# Altium project POWER-BOARD.PrjPcb
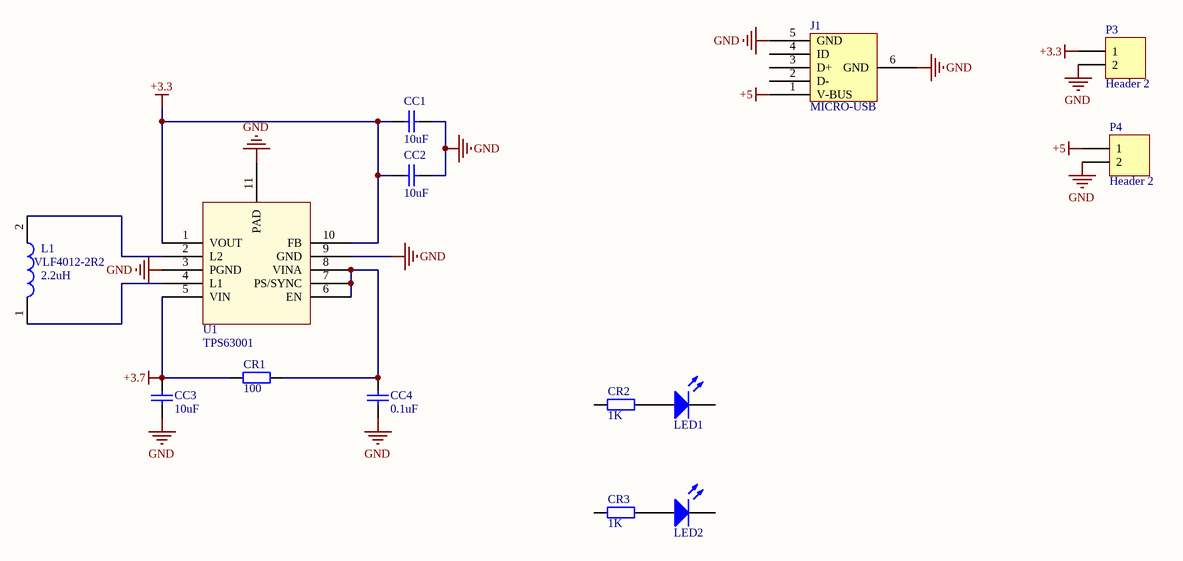
[diagram p0: POWER-BOARD.SchDoc]
1 sheet, 14 parts. Net scope: global (net labels, ports and power ports of the same name join across sheets).
Board file: POWER-BOARD.PcbDoc

## Sheet POWER-BOARD.SchDoc
size A4

### Parts
CC1  value 10uF  [CC1608-0603]  (hidden comment: Cap Chip 0603)
CC2  value 10uF  [CC1608-0603]  (hidden comment: Cap Chip 0603)
CC3  value 10uF  [CC1608-0603]  (hidden comment: Cap Chip 0603)
CC4  value 0.1uF  [CC1005-0402]  (hidden comment: Cap Chip 0402)
CR1  value 100  [CR1005-0402]  (hidden comment: Resistor Chip 0402)
CR2  value 1K  [CR1005-0402]  (hidden comment: Resistor Chip 0402)
CR3  value 1K  [CR1005-0402]  (hidden comment: Resistor Chip 0402)
J1  MICRO-USB  [MICRO-USB]
L1  VLF4012-2R2  L: 2.2uH  [VLF4012-2R2-INDUCTOR]
LED1  LED Chip  [CLED1005-0402]  (value not drawn)
LED2  LED Chip  [CLED1005-0402]  (value not drawn)
P3  Header 2  [HDR1X2]
P4  Header 2  [HDR1X2]
U1  TPS63001  [TPS63001]

### Nets
+3.3: CC1.1 CC2.1 P3.1 U1.1(VOUT) U1.10(FB)
+3.7: CC3.2 CR1.1 U1.5(VIN)
+5: J1.1(V-BUS) P4.1
GND: CC1.2 CC2.2 CC3.1 CC4.1 J1.5(GND) J1.6(GND) P3.2 P4.2 U1.3(PGND) U1.9(GND) U1.11(PAD)
NetCC4_2: CC4.2 CR1.2 U1.6(EN) U1.7(PS/SYNC) U1.8(VINA)
NetCR2_2: CR2.2 LED1.1(A)
NetCR3_2: CR3.2 LED2.1(A)
NetL1_1: L1.1 U1.4(L1)
NetL1_2: L1.2 U1.2(L2)

Not connected (* = marked no-connect by the designer): CR2 1; CR3 1; J1 2(D-) 3(D+) 4(ID); LED1 2(K); LED2 2(K)

### Library data of the parts
CC1-CC3 = Cap Chip 0603: Polarized Capacitor (Radial); Published: 8-Jun-2000; Revision: July-2002: Re-released for DXP Platform.; Publisher: Altium Limited
CC4 = Cap Chip 0402: Polarized Capacitor (Radial); Published: 8-Jun-2000; Revision: July-2002: Re-released for DXP Platform.; Publisher: Altium Limited
CR1-CR3 = Resistor Chip 0402: Resistor; Published: 8-Jun-2000; Revision: July-2002: Re-released for DXP Platform.; Publisher: Altium Limited
LED1 LED2 = LED Chip: Typical Chip LED; Published: 8-Jun-2000; Revision: July-2002: Re-released for DXP Platform.; Publisher: Altium Limited
P3 P4 = Header 2: Header, 2-Pin; LatestRevisionDate: 17-Jul-2002; LatestRevisionNote: Re-released for DXP Platform.; Publisher: Altium Limited